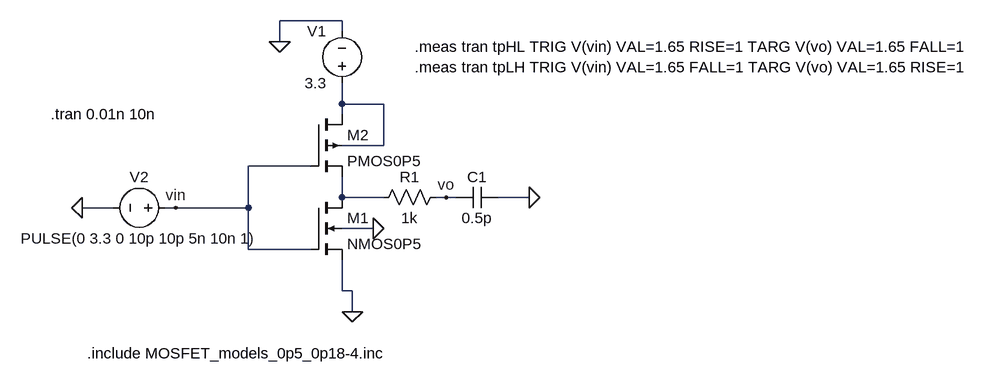
[diagram p0: schematic partA3 pulse matched.asc]
partA3 pulse matched.asc, the LTspice schematic file:
Version 4.1
SHEET 1 1228 680
WIRE 208 -144 112 -144
WIRE 208 -128 208 -144
WIRE 112 -112 112 -144
WIRE 208 -16 208 -48
WIRE 272 -16 208 -16
WIRE 208 0 208 -16
WIRE 272 48 272 -16
WIRE 272 48 208 48
WIRE 160 80 64 80
WIRE 208 128 208 96
WIRE 272 128 208 128
WIRE 368 128 352 128
WIRE 384 128 368 128
WIRE 496 128 448 128
WIRE -144 144 -192 144
WIRE -48 144 -64 144
WIRE 64 144 64 80
WIRE 64 144 -48 144
WIRE 256 176 208 176
WIRE 64 208 64 144
WIRE 160 208 64 208
WIRE 208 272 208 224
WIRE 224 272 208 272
WIRE 224 304 224 272
FLAG 224 304 0
FLAG 112 -112 0
FLAG -192 144 0
FLAG 368 128 vo
FLAG 496 128 0
FLAG -48 144 vin
FLAG 256 176 0
SYMBOL nmos4 160 128 R0
SYMATTR InstName M1
SYMATTR Value NMOS0P5
SYMATTR Value2 l=0.5u w=1.25u
SYMBOL pmos4 160 0 R0
SYMATTR InstName M2
SYMATTR Value PMOS0P5
SYMATTR Value2 l=0.5u w=5u
SYMBOL voltage 208 -32 R180
WINDOW 0 24 96 Left 2
WINDOW 3 24 16 Left 2
WINDOW 123 0 0 Left 0
WINDOW 39 0 0 Left 0
SYMATTR InstName V1
SYMATTR Value 3.3
SYMBOL voltage -48 144 R90
WINDOW 0 -32 56 VBottom 2
WINDOW 3 32 56 VTop 2
WINDOW 123 0 0 Left 0
WINDOW 39 0 0 Left 0
SYMATTR InstName V2
SYMATTR Value PULSE(0 3.3 0 10p 10p 5n 10n 1)
SYMBOL res 368 112 R90
WINDOW 0 0 56 VBottom 2
WINDOW 3 32 56 VTop 2
SYMATTR InstName R1
SYMATTR Value 1k
SYMBOL cap 448 112 R90
WINDOW 0 0 32 VBottom 2
WINDOW 3 32 32 VTop 2
SYMATTR InstName C1
SYMATTR Value 0.5p
TEXT -184 368 Left 2 !.include MOSFET_models_0p5_0p18-4.inc
TEXT -240 0 Left 2 !.tran 0.01n 10n
TEXT 320 -104 Left 2 !.meas tran tpHL TRIG V(vin) VAL=1.65 RISE=1 TARG V(vo) VAL=1.65 FALL=1\n.meas tran tpLH TRIG V(vin) VAL=1.65 FALL=1 TARG V(vo) VAL=1.65 RISE=1

The netlist it stands for:
* partA3 pulse matched.asc
M1 N002 vin 0 0 NMOS0P5 l=0.5u w=1.25u
M2 N001 vin N002 N001 PMOS0P5 l=0.5u w=5u
V1 N001 0 3.3
V2 vin 0 PULSE(0 3.3 0 10p 10p 5n 10n 1)
R1 vo N002 1k
C1 0 vo 0.5p
.model NMOS NMOS
.model PMOS PMOS
.lib standard.mos
.include MOSFET_models_0p5_0p18-4.inc
.tran 0.01n 10n
.meas tran tpHL TRIG V(vin) VAL=1.65 RISE=1 TARG V(vo) VAL=1.65 FALL=1
.meas tran tpLH TRIG V(vin) VAL=1.65 FALL=1 TARG V(vo) VAL=1.65 RISE=1
.backanno
.end